# EAGLE schematic grissom (EAGLE 7.6.0)
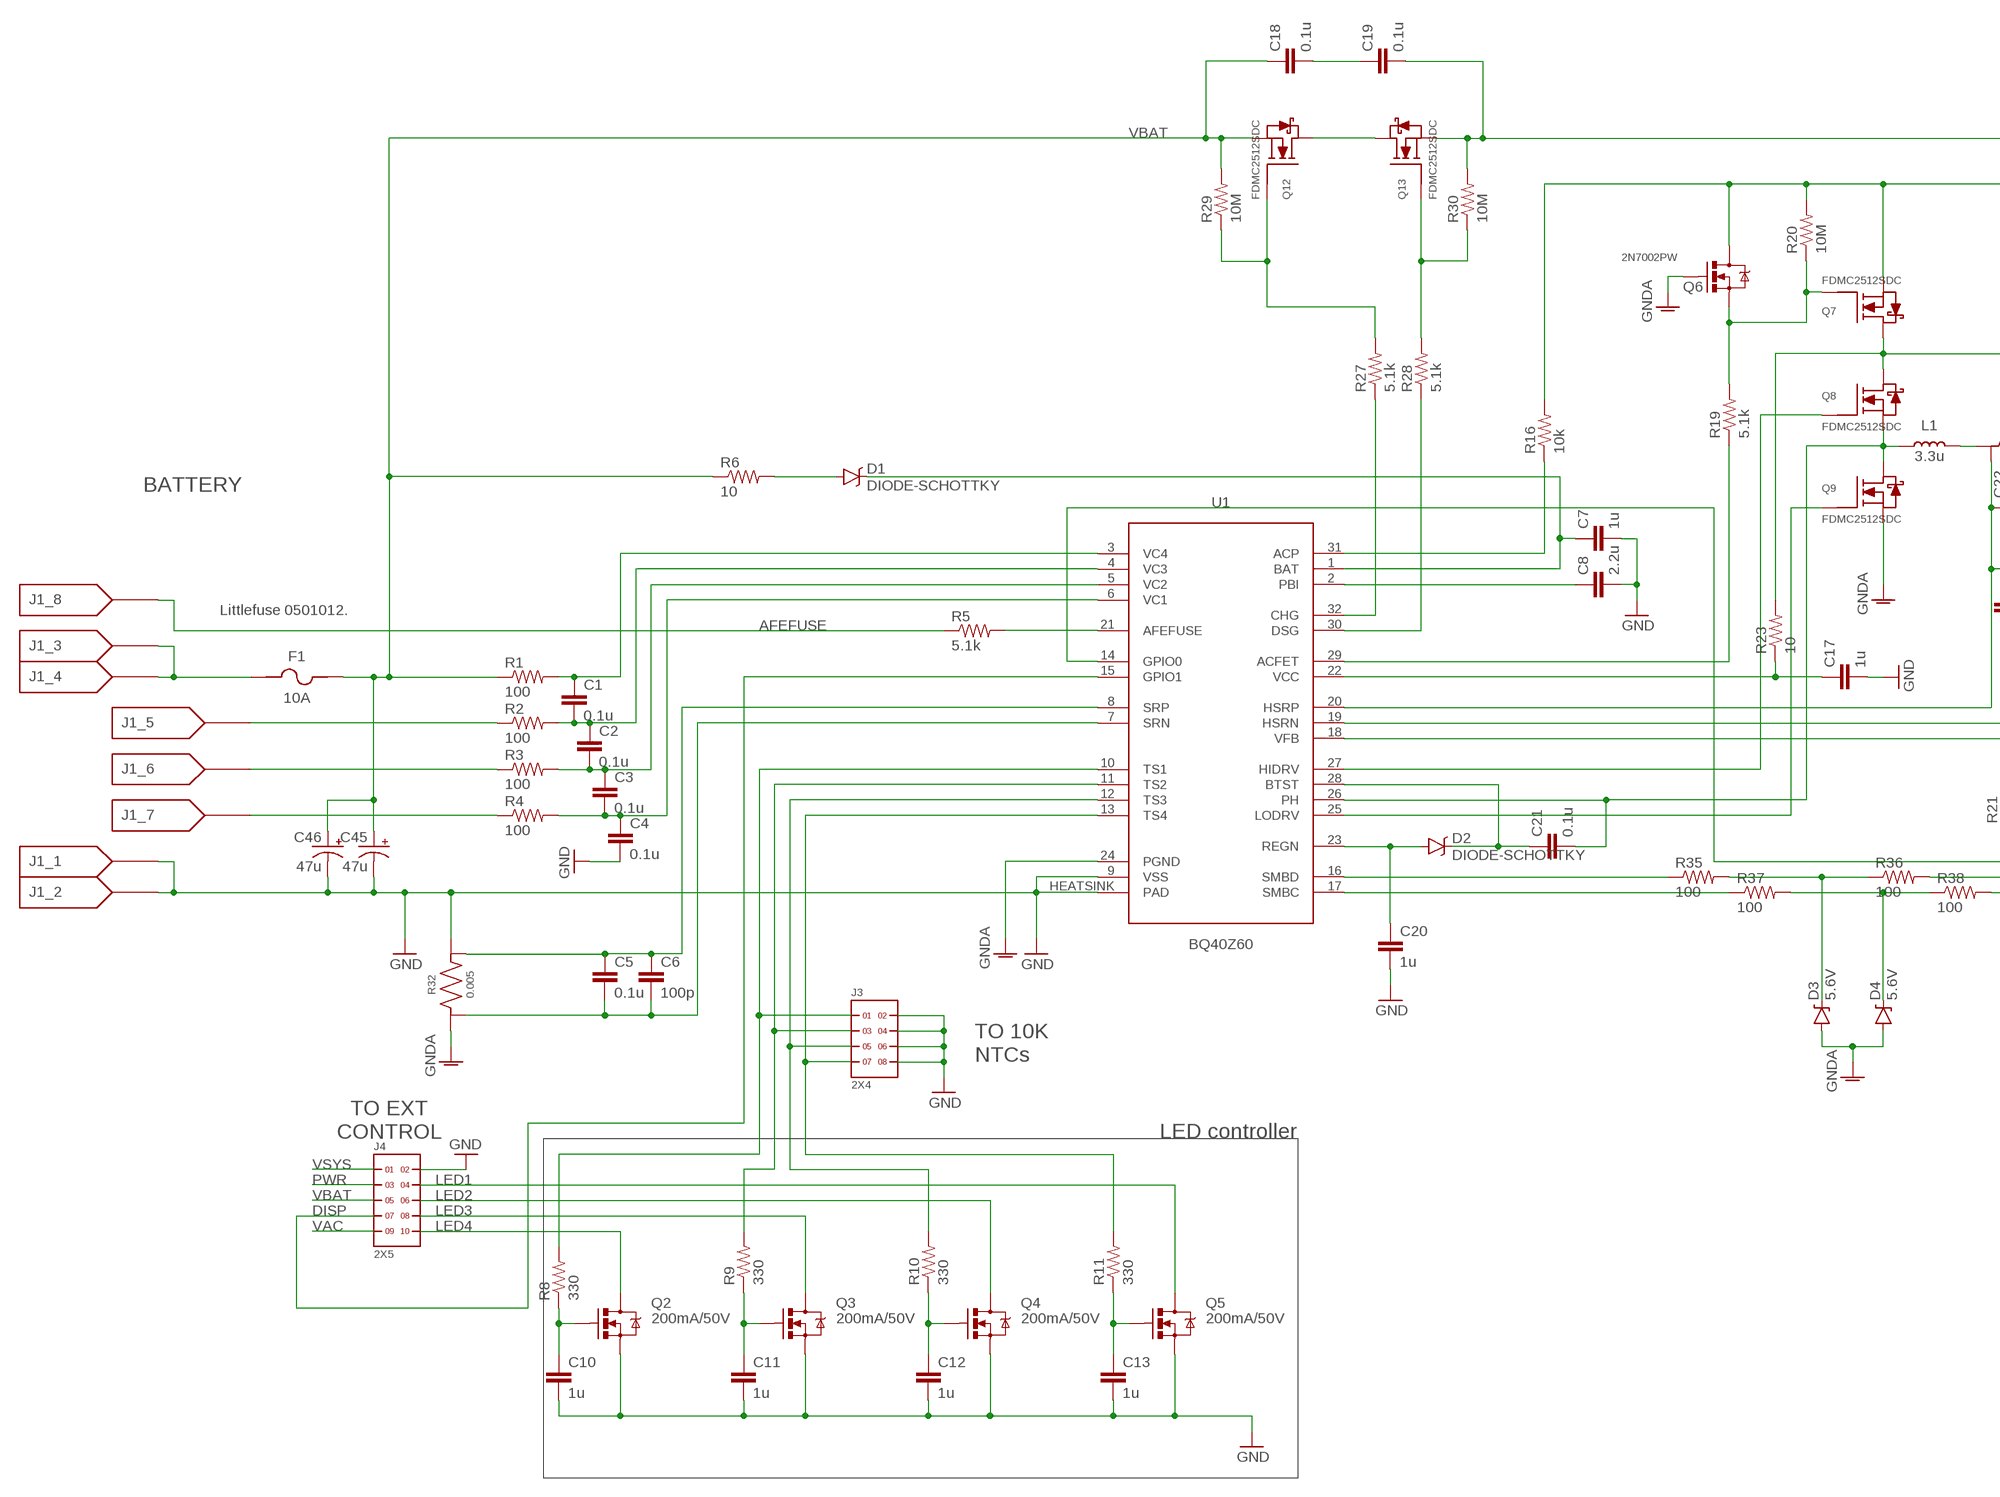
[diagram p0: schematic, sheet 1, part 1 of 2]
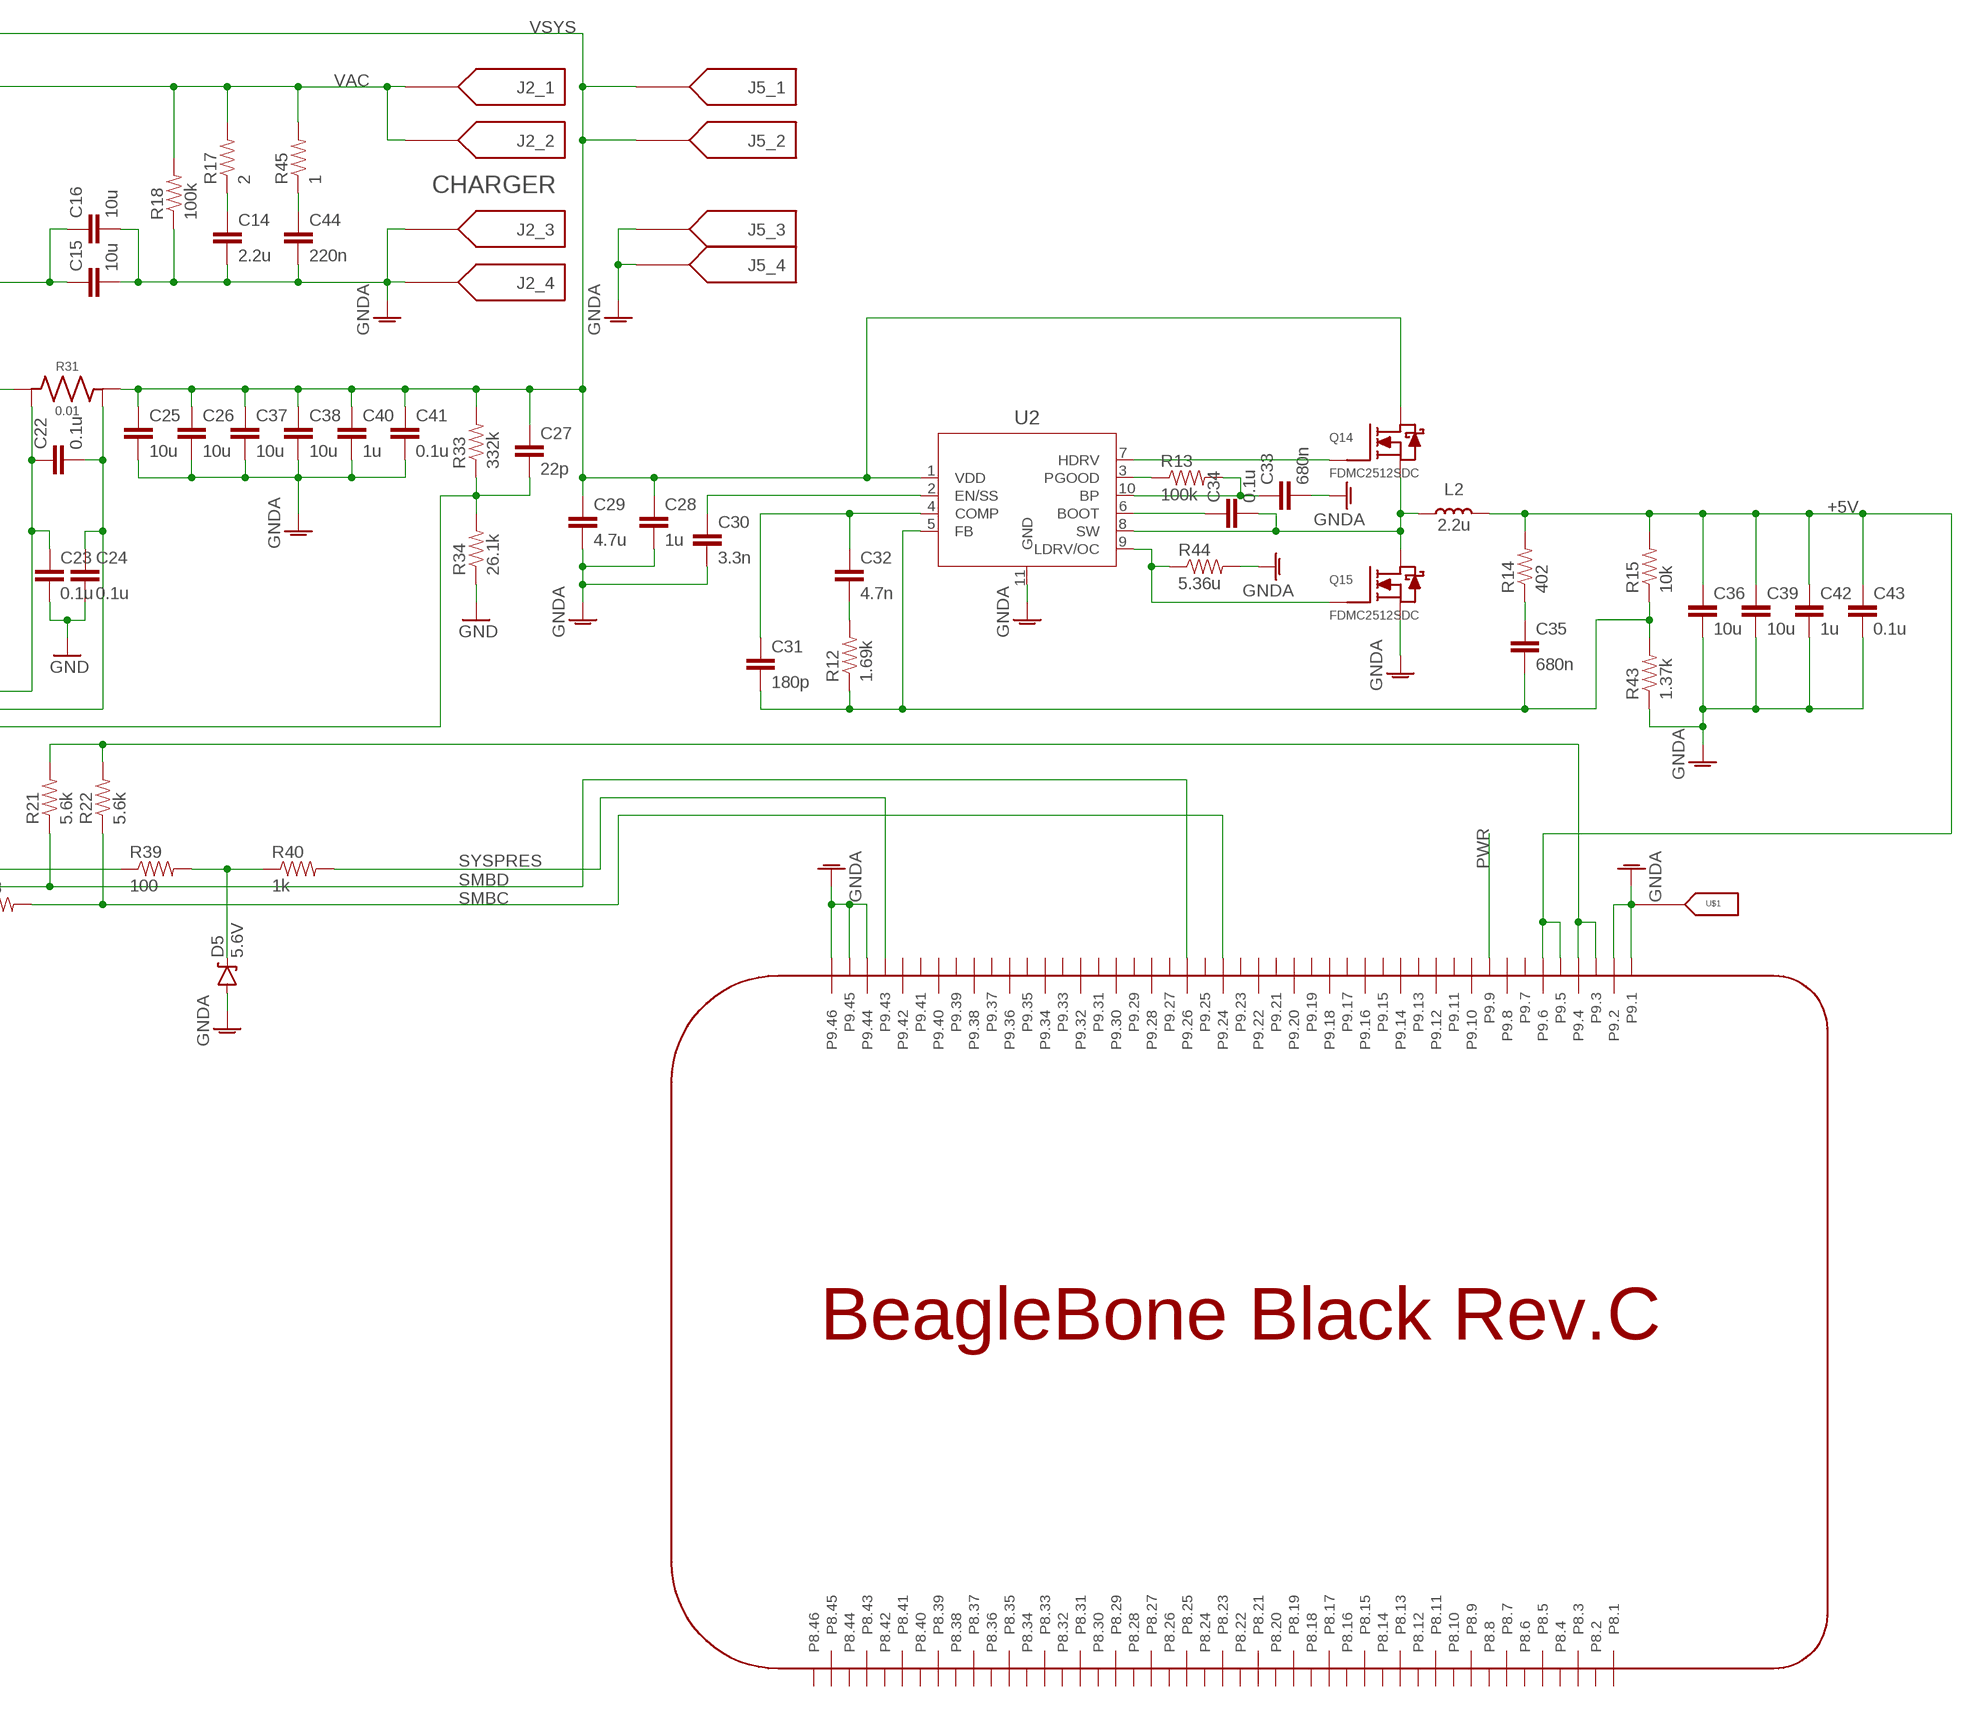
[diagram p1: schematic, sheet 1, part 2 of 2]

## Parts
C1  0.1u  CAP0805  [0805]
C2  0.1u  CAP0805  [0805]
C3  0.1u  CAP0805  [0805]
C4  0.1u  CAP0805  [0805]
C5  0.1u  CAP0805  [0805]
C6  100p  CAP0805  [0805]
C7  1u  CAP0805  [0805]
C8  2.2u  CAP0805  [0805]
C10  1u  CAP0805  [0805]
C11  1u  CAP0805  [0805]
C12  1u  CAP0805  [0805]
C13  1u  CAP0805  [0805]
C14  2.2u  CAP0805  [0805]
C15  10u  CAP1206  [1206]
C16  10u  CAP1206  [1206]
C17  1u  CAP0805  [0805]
C18  0.1u  CAP0805  [0805]
C19  0.1u  CAP0805  [0805]
C20  1u  CAP0805  [0805]
C21  0.1u  CAP0805  [0805]
C22  0.1u  CAP0805  [0805]
C23  0.1u  CAP0805  [0805]
C24  0.1u  CAP0805  [0805]
C25  10u  CAP1206  [1206]
C26  10u  CAP1206  [1206]
C27  22p  CAP0805  [0805]
C28  1u  CAP0805  [0805]
C29  4.7u  CAP0805  [0805]
C30  3.3n  CAP0805  [0805]
C31  180p  CAP0805  [0805]
C32  4.7n  CAP0805  [0805]
C33  680n  CAP0805  [0805]
C34  0.1u  CAP0805  [0805]
C35  680n  CAP0805  [0805]
C36  10u  CAP1206  [1206]
C37  10u  CAP1206  [1206]
C38  10u  CAP1206  [1206]
C39  10u  CAP1206  [1206]
C40  1u  CAP1206  [1206]
C41  0.1u  CAP1206  [1206]
C42  1u  CAP1206  [1206]
C43  0.1u  CAP1206  [1206]
C44  220n  CAP0805  [0805]
C45  47u  CAP_POLPTH2  [CPOL-RADIAL-10UF-25V]
C46  47u  CAP_POLPTH2  [CPOL-RADIAL-10UF-25V]
D1  DIODE-SCHOTTKY  [SOT23-3]
D2  DIODE-SCHOTTKY  [SOT23-3]
D3  5.6V  DIODE-ZENER5.6V  [SOD-323]
D4  5.6V  DIODE-ZENER5.6V  [SOD-323]
D5  5.6V  DIODE-ZENER5.6V  [SOD-323]
F1  10A  LITTELFUSE_501  [LITTELFUSE_501]
J1  105314-X208  [105314-X208]
J2  105314-X204  [105314-X204]
J3  2X4  [2X4]
J4  2X5  [2X5]
J5  105314-X204  [105314-X204]
L1  3.3u  BOURNS_SRP7028A  [BOURNS_SRP7028A]
L2  2.2u  BOURNS_SRP7028A  [BOURNS_SRP7028A]
PCB1  BEAGLEBONE_BLACK_BLANK  [BEAGLEBONE_BLACK_BLANK]
Q2  200mA/50V  MOSFET-NCHANNELBSS138  [SOT23-3]
Q3  200mA/50V  MOSFET-NCHANNELBSS138  [SOT23-3]
Q4  200mA/50V  MOSFET-NCHANNELBSS138  [SOT23-3]
Q5  200mA/50V  MOSFET-NCHANNELBSS138  [SOT23-3]
Q6  2N7002PW  MOSFET-NCHANNEL2N7002PW  [SOT323]
Q7  FDMC2512SDC  [MO240]
Q8  FDMC2512SDC  [MO240]
Q9  FDMC2512SDC  [MO240]
Q12  FDMC2512SDC  [MO240]
Q13  FDMC2512SDC  [MO240]
Q14  FDMC2512SDC  [MO240]
Q15  FDMC2512SDC  [MO240]
R1  100  RESISTOR0805-RES  [0805]
R2  100  RESISTOR0805-RES  [0805]
R3  100  RESISTOR0805-RES  [0805]
R4  100  RESISTOR0805-RES  [0805]
R5  5.1k  RESISTOR0805-RES  [0805]
R6  10  RESISTOR1206  [1206]
R8  330  RESISTOR0805-RES  [0805]
R9  330  RESISTOR0805-RES  [0805]
R10  330  RESISTOR0805-RES  [0805]
R11  330  RESISTOR0805-RES  [0805]
R12  1.69k  RESISTOR0805-RES  [0805]
R13  100k  RESISTOR0805-RES  [0805]
R14  402  RESISTOR0805-RES  [0805]
R15  10k  RESISTOR0805-RES  [0805]
R16  10k  RESISTOR0805-RES  [0805]
R17  2  RESISTOR0805-RES  [0805]
R18  100k  RESISTOR0805-RES  [0805]
R19  5.1k  RESISTOR0805-RES  [0805]
R20  10M  RESISTOR0805-RES  [0805]
R21  5.6k  RESISTOR0805-RES  [0805]
R22  5.6k  RESISTOR0805-RES  [0805]
R23  10  RESISTOR0805-RES  [0805]
R27  5.1k  RESISTOR0805-RES  [0805]
R28  5.1k  RESISTOR0805-RES  [0805]
R29  10M  RESISTOR0805-RES  [0805]
R30  10M  RESISTOR0805-RES  [0805]
R31  0.01  OHMITE_FC4L32  [1206_4T]
R32  0.005  VISHAY_WSK0612  [0612_4T]
R33  332k  RESISTOR0805-RES  [0805]
R34  26.1k  RESISTOR0805-RES  [0805]
R35  100  RESISTOR0805-RES  [0805]
R36  100  RESISTOR0805-RES  [0805]
R37  100  RESISTOR0805-RES  [0805]
R38  100  RESISTOR0805-RES  [0805]
R39  100  RESISTOR0805-RES  [0805]
R40  1k  RESISTOR0805-RES  [0805]
R43  1.37k  RESISTOR0805-RES  [0805]
R44  5.36u  RESISTOR0805-RES  [0805]
R45  1  RESISTOR0805-RES  [0805]
U1  BQ40Z60  [QFN32]
U2  TPS40305DRCR  [S-PVSON-N10]
U$1  SU_LOGO-DUMMY2  [SU_LOGO_SS]

## Nets
+5V: C36.1 C39.1 C42.1 C43.1 L2.P$2 PCB1.P9.5 PCB1.P9.6 R14.2 R15.2
AFEFUSE: J1.P$8 R5.1
DISP: J4.7 U1.15(GPIO1)
GND: C4.2 C7.2 C8.2 C10.2 C11.2 C12.2 C13.2 C17.2 C20.2 C23.2 C24.2 C45.2(-) C46.2(-) J1.P$1 J1.P$2 J3.2 J3.4 J3.6 J3.8 J4.2 Q2.2(S) Q3.2(S) Q4.2(S) Q5.2(S) R32.P$2 R34.1 U1.9(VSS) U1.HEATSINK(PAD)
GNDA: C14.2 C15.2 C16.2 C25.2 C26.2 C28.2 C29.2 C30.2 C33.2 C36.2 C37.2 C38.2 C39.2 C40.2 C41.2 C42.2 C43.2 C44.2 D3.A D4.A D5.A J2.P$3 J2.P$4 J5.P$3 J5.P$4 PCB1.P9.1 PCB1.P9.2 PCB1.P9.44 PCB1.P9.45 PCB1.P9.46 Q6.1(G) Q9.P$1(S) Q9.P$2(S) Q9.P$3(S) Q15.P$1(S) Q15.P$2(S) Q15.P$3(S) R18.1 R32.P$1 R43.1 R44.2 U1.24(PGND) U2.11(GND) U$1.P$1
LED1: J4.4 Q5.3(D)
LED2: J4.6 Q4.3(D)
LED3: J4.8 Q3.3(D)
LED4: J4.10 Q2.3(D)
N$1: R5.2 U1.21(AFEFUSE)
N$2: J1.P$5 R2.1
N$3: J1.P$6 R3.1
N$4: J1.P$7 R4.1
N$5: F1.P$1 J1.P$3 J1.P$4
N$6: C3.2 C4.1 R4.2 U1.6(VC1)
N$7: C1.1 R1.2 U1.3(VC4)
N$8: C1.2 C2.1 R2.2 U1.4(VC3)
N$9: C2.2 C3.1 R3.2 U1.5(VC2)
N$10: C5.1 C6.1 R32.P$4 U1.8(SRP)
N$11: C5.2 C6.2 R32.P$3 U1.7(SRN)
N$13: D1.1(A) D1.2(A) R6.2
N$14: C7.1 D1.3(C) U1.1(BAT)
N$15: C8.1 U1.2(PBI)
N$16: PCB1.P9.3 PCB1.P9.4 R21.2 R22.2
N$18: C17.1 R23.1 U1.22(VCC)
N$20: J3.1 R8.2 U1.10(TS1)
N$21: J3.3 R9.2 U1.11(TS2)
N$22: J3.5 R10.2 U1.12(TS3)
N$23: J3.7 R11.2 U1.13(TS4)
N$24: C10.1 Q2.1(G) R8.1
N$26: C11.1 Q3.1(G) R9.1
N$28: C12.1 Q4.1(G) R10.1
N$30: C13.1 Q5.1(G) R11.1
N$32: C32.2 R12.2
N$33: C30.1 U2.2(EN/SS)
N$34: C31.1 C32.1 U2.4(COMP)
N$35: C31.2 C35.2 R12.1 R15.1 R43.2 U2.5(FB)
N$36: C14.1 R17.1
N$37: R16.1 U1.31(ACP)
N$38: C34.2 L2.P$1 Q14.P$1(S) Q14.P$2(S) Q14.P$3(S) Q15.P$5(D) Q15.P$6(D) Q15.P$7(D) Q15.P$8(D) Q15.PAD(D) U2.8(SW)
N$39: C15.1 C16.1 Q7.P$5(D) Q7.P$6(D) Q7.P$7(D) Q7.P$8(D) Q7.PAD(D) Q8.P$5(D) Q8.P$6(D) Q8.P$7(D) Q8.P$8(D) Q8.PAD(D) R23.2
N$40: Q6.2(S) Q7.P$4(G) R19.2 R20.1
N$41: R19.1 U1.29(ACFET)
N$42: Q14.P$4(G) U2.7(HDRV)
N$43: Q8.P$4(G) U1.27(HIDRV)
N$45: Q9.P$4(G) U1.25(LODRV)
N$47: Q15.P$4(G) R44.1 U2.9(LDRV/OC)
N$48: R28.1 U1.30(DSG)
N$49: R27.1 U1.32(CHG)
N$50: Q13.P$4(G) R28.2 R30.1
N$51: Q12.P$4(G) R27.2 R29.1
N$52: Q12.P$5(D) Q12.P$6(D) Q12.P$7(D) Q12.P$8(D) Q12.PAD(D) Q13.P$5(D) Q13.P$6(D) Q13.P$7(D) Q13.P$8(D) Q13.PAD(D)
N$53: R13.1 U2.3(PGOOD)
N$54: C21.1 D2.3(C) U1.28(BTST)
N$55: C18.2 C19.1
N$56: C21.2 L1.P$1 Q8.P$1(S) Q8.P$2(S) Q8.P$3(S) Q9.P$5(D) Q9.P$6(D) Q9.P$7(D) Q9.P$8(D) Q9.PAD(D) U1.26(PH)
N$57: C20.1 D2.1(A) D2.2(A) U1.23(REGN)
N$58: L1.P$2 R31.P$1
N$59: C22.1 C23.1 R31.P$3 U1.20(HSRP)
N$60: C22.2 C24.1 R31.P$4 U1.19(HSRN)
N$62: C27.2 R33.1 R34.2 U1.18(VFB)
N$64: R35.1 U1.16(SMBD)
N$65: D3.C R35.2 R36.1
N$66: PCB1.P9.26 R21.1 R36.2
N$67: R37.1 U1.17(SMBC)
N$68: D4.C R37.2 R38.1
N$69: PCB1.P9.24 R22.1 R38.2
N$70: C33.1 R13.2 U2.10(BP)
N$71: R39.1 U1.14(GPIO0)
N$72: D5.C R39.2 R40.1
N$73: PCB1.P9.43 R40.2
N$74: C34.1 U2.6(BOOT)
N$76: C35.1 R14.1
N$77: C44.1 R45.1
PWR: J4.3 PCB1.P9.9
VAC: J2.P$1 J2.P$2 J4.9 Q6.3(D) Q7.P$1(S) Q7.P$2(S) Q7.P$3(S) R16.2 R17.2 R18.2 R20.2 R45.2
VBAT: C18.1 C45.1(+) C46.1(+) F1.P$2 J4.5 Q12.P$1(S) Q12.P$2(S) Q12.P$3(S) R1.1 R6.1 R29.2
VSYS: C19.2 C25.1 C26.1 C27.1 C28.1 C29.1 C37.1 C38.1 C40.1 C41.1 J4.1 J5.P$1 J5.P$2 Q13.P$1(S) Q13.P$2(S) Q13.P$3(S) Q14.P$5(D) Q14.P$6(D) Q14.P$7(D) Q14.P$8(D) Q14.PAD(D) R30.2 R31.P$2 R33.2 U2.1(VDD)
Unconnected: PCB1.P8.1 PCB1.P8.2 PCB1.P8.3 PCB1.P8.4 PCB1.P8.5 PCB1.P8.6 PCB1.P8.7 PCB1.P8.8 PCB1.P8.9 PCB1.P8.10 PCB1.P8.11 PCB1.P8.12 PCB1.P8.13 PCB1.P8.14 PCB1.P8.15 PCB1.P8.16 PCB1.P8.17 PCB1.P8.18 PCB1.P8.19 PCB1.P8.20 PCB1.P8.21 PCB1.P8.22 PCB1.P8.23 PCB1.P8.24 PCB1.P8.25 PCB1.P8.26 PCB1.P8.27 PCB1.P8.28 PCB1.P8.29 PCB1.P8.30 PCB1.P8.31 PCB1.P8.32 PCB1.P8.33 PCB1.P8.34 PCB1.P8.35 PCB1.P8.36 PCB1.P8.37 PCB1.P8.38 PCB1.P8.39 PCB1.P8.40 PCB1.P8.41 PCB1.P8.42 PCB1.P8.43 PCB1.P8.44 PCB1.P8.45 PCB1.P8.46 PCB1.P9.7 PCB1.P9.8 PCB1.P9.10 PCB1.P9.11 PCB1.P9.12 PCB1.P9.13 PCB1.P9.14 PCB1.P9.15 PCB1.P9.16 PCB1.P9.17 PCB1.P9.18 PCB1.P9.19 PCB1.P9.20 PCB1.P9.21 PCB1.P9.22 PCB1.P9.23 PCB1.P9.25 PCB1.P9.27 PCB1.P9.28 PCB1.P9.29 PCB1.P9.30 PCB1.P9.31 PCB1.P9.32 PCB1.P9.33 PCB1.P9.34 PCB1.P9.35 PCB1.P9.36 PCB1.P9.37 PCB1.P9.38 PCB1.P9.39 PCB1.P9.40 PCB1.P9.41 PCB1.P9.42

## Notes on the sheet
- CHARGER
- BATTERY
- Littlefuse 0501012.
- SYSPRES
  SMBD
  SMBC
- TO 10K
  NTCs
- TO EXT
  CONTROL
- LED controller

## Library data of the parts
C1-C8 C10-C44 = SparkFun-Capacitors:CAP: Capacitor Standard 0603 ceramic capacitor, and 0.1" leaded capacitor.
C45 C46 = SparkFun-Capacitors:CAP_POL: Capacitor Polarized These are standard SMD and PTH capacitors. Normally 10uF, 47uF, and 100uF in electrolytic and tantalum varieties. Always verify the external diameter of the through hole cap, it varies with capacity, voltage, and manufacturer. The EIA devices should be standard.
D1 D2 = SparkFun-DiscreteSemi:DIODE-SCHOTTKY: Schottky diodes in SFE's production catalog BAT20J 1A 23V 0.62Vf RB751 120mA 40V 0.37Vf PMEG4005EJ 0.5A 40V 0.42Vf MBRA140 1A 40V 0.5Vf B340A 3A 40V SMA
D3-D5 = SparkFun-DiscreteSemi:DIODE-ZENER: Zener Diode Production Part - 8199 3.4V Zener Voltage; PROD_ID: DIO-12442
F1 = components:LITTELFUSE_501
J1 = molex_nanofit:105314-X208
J2 J5 = molex_nanofit:105314-X204
J3 = headers(2mm):2X4
J4 = headers(2mm):2X5
L1 L2 = components:BOURNS_SRP7028A
PCB1 = e14_BeagleBoneBlack_RevB:BEAGLEBONE_BLACK_BLANK
Q2-Q5 = SparkFun-DiscreteSemi:MOSFET-NCHANNEL: Common NMOSFET Parts MFG P/N Store ID Prod ID FDD8780 TRANS-09984 SI7820DN TRANS-11055 FDS6630A IC-08089 2N7002PW TRANS-11151 FQP30N06L COM-10213 TRANS-10060 BSS123LT1G TRANS-08345 BSS138 TRANS-00830 BS170 2N7000; PROD_ID: TRANS-00830
Q6 = SparkFun-DiscreteSemi:MOSFET-NCHANNEL: Common NMOSFET Parts MFG P/N Store ID Prod ID FDD8780 TRANS-09984 SI7820DN TRANS-11055 FDS6630A IC-08089 2N7002PW TRANS-11151 FQP30N06L COM-10213 TRANS-10060 BSS123LT1G TRANS-08345 BSS138 TRANS-00830 BS170 2N7000; PROD_ID: TRANS-11151
Q7-Q9 Q12-Q15 = components:FDMC2512SDC
R1-R6 R8-R23 R27-R30 R33-R40 R43-R45 = SparkFun-Resistors:RESISTOR: Resistor Basic schematic elements and footprints for 0603, 1206, and PTH resistors.
R31 = components:OHMITE_FC4L32
R32 = components:VISHAY_WSK0612
U1 = components:BQ40Z60
U2 = TPS40305:TPS40305DRCR; DATASHEETURL: http://www.ti.com/product/tps40305; FREQUENCY: 1200000.0; IMAX: 25.0; MANUFACTURER_NAME: Texas Instruments; MANUFACTURER_PART_NUMBER: TPS40305DRCR; MKTG_PACKAGE: TPS40305; NSID: TPS40305DRCT; PACKAGE: TPS40305; VENDOR: Texas Instruments
U$1 = components:SU_LOGO-DUMMY2